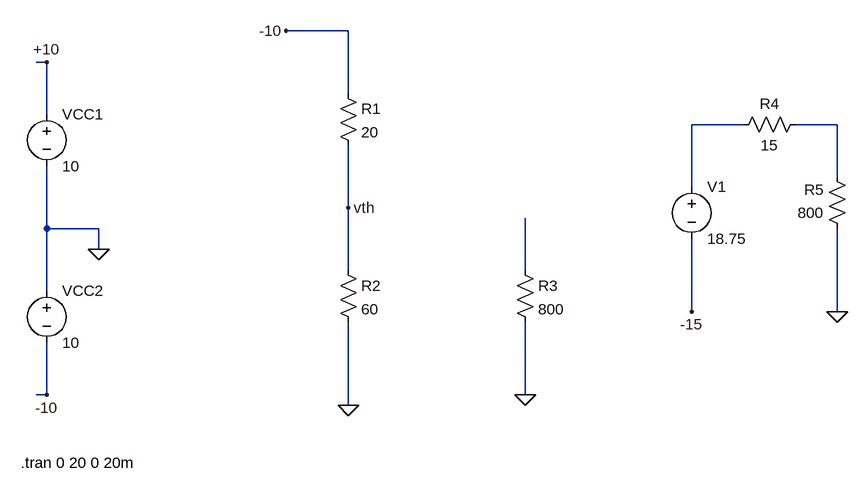
[diagram p0: schematic Draft1.asc]
Draft1.asc, the LTspice schematic file:
Version 4
SHEET 1 1188 680
WIRE 416 -208 320 -208
WIRE -48 -160 -64 -160
WIRE 416 -112 416 -208
WIRE -48 -80 -48 -160
WIRE 1024 -64 944 -64
WIRE 1168 -64 1104 -64
WIRE 1168 16 1168 -64
WIRE 944 32 944 -64
WIRE 416 64 416 -32
WIRE -48 96 -48 0
WIRE 32 96 -48 96
WIRE 32 128 32 96
WIRE 416 160 416 64
WIRE 688 160 688 80
WIRE -48 192 -48 96
WIRE 944 224 944 112
WIRE 1168 224 1168 96
WIRE -48 352 -48 272
WIRE -48 352 -64 352
WIRE 688 352 688 240
WIRE 416 368 416 240
FLAG -48 -160 +10
FLAG 32 128 0
FLAG -48 352 -10
FLAG 416 64 vth
FLAG 320 -208 -10
FLAG 688 352 0
FLAG 1168 224 0
FLAG 944 224 -15
FLAG 416 368 0
SYMBOL voltage -48 -96 R0
WINDOW 123 0 0 Left 0
WINDOW 39 0 0 Left 0
SYMATTR InstName VCC1
SYMATTR Value 10
SYMBOL voltage -48 176 R0
WINDOW 123 0 0 Left 0
WINDOW 39 0 0 Left 0
SYMATTR InstName VCC2
SYMATTR Value 10
SYMBOL res 400 -128 R0
SYMATTR InstName R1
SYMATTR Value 20
SYMBOL res 400 144 R0
SYMATTR InstName R2
SYMATTR Value 60
SYMBOL res 672 144 R0
SYMATTR InstName R3
SYMATTR Value 800
SYMBOL voltage 944 16 R0
WINDOW 123 0 0 Left 0
WINDOW 39 0 0 Left 0
SYMATTR InstName V1
SYMATTR Value 18.75
SYMBOL res 1120 -80 R90
WINDOW 0 0 56 VBottom 2
WINDOW 3 32 56 VTop 2
SYMATTR InstName R4
SYMATTR Value 15
SYMBOL res 1184 112 R180
WINDOW 0 36 76 Left 2
WINDOW 3 36 40 Left 2
SYMATTR InstName R5
SYMATTR Value 800
TEXT -88 456 Left 2 !.tran 0 20 0 20m

The netlist it stands for:
* Draft1.asc
VCC1 +10 0 10
VCC2 0 -10 10
R1 -10 vth 20
R2 vth 0 60
R3 N003 0 800
V1 N001 -15 18.75
R4 N002 N001 15
R5 0 N002 800
.tran 0 20 0 20m
.backanno
.end